# Altium schematic sheet Schematic4.SchDoc
size A4
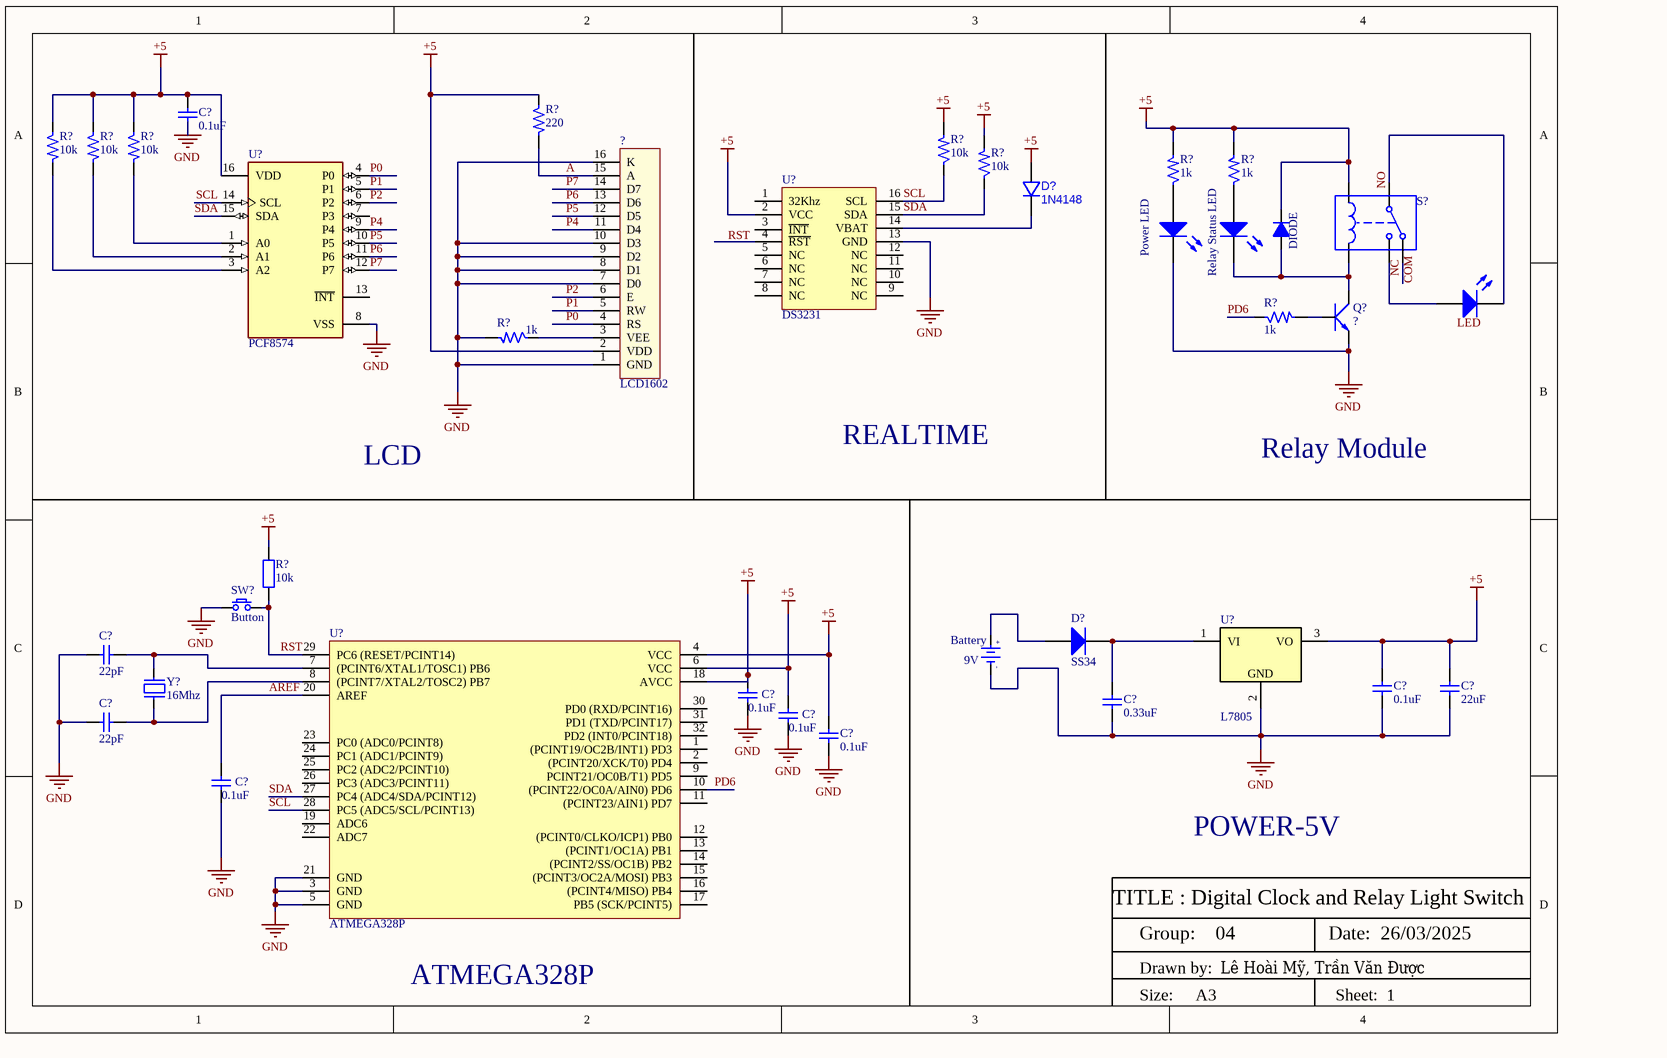
[diagram p0: Schematic4.SchDoc]

## Parts
(Parts that share a designator on the sheet are numbered #1, #2 ... from top to bottom, then left to right.)
?  LCD1602  [LCD1602 with Jump]
Battery  9V  [De Pin 9V]
C?#1  0.1uF  [C 0402 (1005)]
C?#2  22pF  [C 0402 (1005)]
C?#3  0.1uF  [C 0402 (1005)]
C?#4  22uF  [C 0402 (1005)]
C?#5  0.33uF  [C 0402 (1005)]
C?#6  0.1uF  [C 0402 (1005)]
C?#7  22pF  [C 0402 (1005)]
C?#8  0.1uF  [C 0402 (1005)]
C?#9  0.1uF  [C 0402 (1005)]
C?#10  0.1uF  [C 0402 (1005)]
D?#1  1N4148  [SOD523F]
D?#2  SS34  [DIODE SMA]
DIODE  100v  [DIODE 1A]  (value not drawn)
Power_LED  Light-Emitting Diode  (value not drawn)
Power_LED?  Light-Emitting Diode  (value not drawn)
Q?  ?  [TO92]
R?#1  220  [R1/4W]
R?#2  10k  [SM-RES-1206]
R?#3  10k  [SM-RES-1206]
R?#4  10k  [SM-RES-1206]
R?#5  10k  [R1/4W]
R?#6  10k  [R1/4W]
R?#7  1k  [R1/4W]
R?#8  1k  [R1/4W]
R?#9  1k  [R1/4W]
R?#10  1k  [R1/4W]
R?#11  10k  [tro vach 1/4w]
Relay_Status_LED  Light-Emitting Diode  (value not drawn)
S?  Single-Pole, Double-Throw Relay  (value not drawn)
SW?  Button  [SW/2/DIP]
U?#1  PCF8574  [FP-SOT162-1-MFG]
U?#2  DS3231  [SOIC 16]
U?#3  L7805  [DPAK_118_446_112X59_SMD]
U?#4  ATMEGA328P  [TQFP-32]
Y?  16Mhz  [Thach Anh 2 chan SMD]

## Nets
+5: ?.2(VDD) C?#1.2 C?#3.1 C?#4.1 C?#6.2 C?#8.2 C?#9.2 D?#1.A DIODE.2(K) R?#1.1 R?#2.1 R?#3.1 R?#4.1 R?#5.2 R?#6.2 R?#7.2 R?#8.2 R?#11.2 S?.4 U?#1.16(VDD) U?#2.2(VCC) U?#3.3(VO) U?#4.4(VCC) U?#4.6(VCC) U?#4.18(AVCC)
GND: ?.1(GND) ?.7(D0) ?.8(D1) ?.9(D2) ?.10(D3) ?.16(K) Battery.2(GND) C?#1.1 C?#2.2 C?#3.2 C?#4.2 C?#5.2 C?#6.1 C?#7.1 C?#8.1 C?#9.1 C?#10.1 Power_LED.2(K) Q?.1(E) R?#10.2 SW?.1 U?#1.8(VSS) U?#2.13(GND) U?#3.2 U?#4.3(GND) U?#4.5(GND) U?#4.21(GND)
A: ?.15(A) R?#1.2
AREF: C?#10.2 U?#4.20(AREF)
NC: S?.3
P0: ?.4(RS) U?#1.4(P0)
P1: ?.5(RW) U?#1.5(P1)
P2: ?.6(E) U?#1.6(P2)
P4: ?.11(D4) U?#1.9(P4)
P5: ?.12(D5) U?#1.10(P5)
P6: ?.13(D6) U?#1.11(P6)
P7: ?.14(D7) U?#1.12(P7)
PD6: R?#9.1 U?#4.10((PCINT22/OC0A/AIN0)_PD6)
RST: R?#11.1 SW?.2 U?#4.29(PC6_(RESET/PCINT14))
SCL: R?#5.1 U?#1.14(SCL) U?#2.16(SCL) U?#4.28(PC5_(ADC5/SCL/PCINT13))
SDA: R?#6.1 U?#1.15(SDA) U?#2.15(SDA) U?#4.27(PC4_(ADC4/SDA/PCINT12))
Net?_3: ?.3(VEE) R?#10.1
NetBattery_1: Battery.1(+3V) D?#2.1(A)
NetC?#2_1: C?#2.1 U?#4.7((PCINT6/XTAL1/TOSC1)_PB6) Y?.2
NetC?#5_1: C?#5.1 D?#2.2(K) U?#3.1(VI)
NetC?#7_2: C?#7.2 U?#4.8((PCINT7/XTAL2/TOSC2)_PB7) Y?.1
NetD?#1_K: D?#1.K U?#2.14(VBAT)
NetDIODE_1: DIODE.1(A) Q?.3(C) Relay_Status_LED.2(K) S?.5
NetPower_LED?_1: Power_LED?.1(A) S?.2
NetPower_LED?_2: Power_LED?.2(K) S?.1
NetPower_LED_1: Power_LED.1(A) R?#7.1
NetQ?_2: Q?.2(B) R?#9.2
NetR?#2_2: R?#2.2 U?#1.3(A2)
NetR?#3_2: R?#3.2 U?#1.2(A1)
NetR?#4_2: R?#4.2 U?#1.1(A0)
NetR?#8_1: R?#8.1 Relay_Status_LED.1(A)

Not connected (* = marked no-connect by the designer): U?#1 7(P3) 13(~{INT}); U?#2 1(32Khz) 3(~{INT}) 4(~{RST}) 5(NC) 6(NC) 7(NC) 8(NC) 9(NC) 10(NC) 11(NC) 12(NC); U?#4 1((PCINT19/OC2B/INT1)_PD3) 2((PCINT20/XCK/T0)_PD4) 9(PCINT21/OC0B/T1)_PD5) 11((PCINT23/AIN1)_PD7) 12((PCINT0/CLKO/ICP1)_PB0) 13((PCINT1/OC1A)_PB1) 14((PCINT2/SS/OC1B)_PB2) 15((PCINT3/OC2A/MOSI)_PB3) 16((PCINT4/MISO)_PB4) 17(PB5_(SCK/PCINT5)) 19(ADC6) 22(ADC7) 23(PC0_(ADC0/PCINT8)) 24(PC1_(ADC1/PCINT9)) 25(PC2_(ADC2/PCINT10)) 26(PC3_(ADC3/PCINT11)) 30(PD0_(RXD/PCINT16)) 31(PD1_(TXD/PCINT17)) 32(PD2_(INT0/PCINT18))

## Notes on the sheet
- REALTIME
- LCD
- Relay Module
- POWER-5V
- TITLE : Digital Clock and Relay Light Switch
- ATMEGA328P
- Group:    04
- Drawn by:
- Lê Hoài Mỹ, Trần Văn Được
- Date:  26/03/2025
- Size:     A3
- Sheet:  1
- Labels drawn without touching a wire or pin: COM, LED, NO, RST
- (in symbol De pin 9V cam) +; -
- (in symbol REG_35V_5V-1.5A-7.5W-DPAK) GND

## Library data of the parts
? = LCD1602 XL: LCD 1602 Xanh Lá; Ten: Màn hình LCD 1602 Xanh Lá; Ma_Hang: 67HZ; NCC: NSHOP; CHIP: HD44780
Battery = De pin 9V cam: De Pin 9V; Ten: Hộp Đế Pin 9V Thường; Ma_Hang: MH002680
C?#1-C?#10 = Capacitor NP: Capacitor non-pol
D?#1 = DIODE_1N4148_200mA_SOD523F: Diode SMD small signal 0.2A SOD-523F; Manufacturer 1: Fairchild Semiconductor; Manufacturer Part Number 1: 1N4148WT; Ratings: Vr=75V; Vf=1V@10mA; Io=200mA; Material: Si; SCDType: source; Package / Case: SC-79, SOD-523F; Supplier 1: Digi-Key; Supplier Part Number 1: 1N4148WTCT-ND; ComponentLink1URL: http://www.fairchildsemi.com/ds/1N/1N914BWT.pdf; ComponentLink1Description: http://www.fairchildsemi.com/ds/1N/1N914BWT.pdf; Value: 1N4148
D?#2 = Diode SS34 ( 1N5822 ): Dán; Don_Vi: Con; Ma_Hang: MH002104; Ten_Linh_Kien: Diode SS34 3A 40V SMA ( 1N5822 SS34A); Kieu_Chan: *; Chung_Loai: Dán
DIODE = Diode 1N4007: Cắm; Ten_Linh_Kien: Diode 1N4007 1A (DIP); Don_Vi: Con; Ma_Hang: MH001063; Ghi Chu: *; Kieu_Chan: *; Chung_Loai: Cắm
Power_LED Power_LED? Relay_Status_LED = LED: AF: 1; BV: 0; BV_MAX: 1e99; EG: 1.11; FC: 0.5; IBV: 0.001; IS: 1e-14; MJSW: 0.33; NTUN: 30; TNOM: 27; XTI: 3; SimulationGenericComponent: True; CJO: 0; CJP: 0; CTA: 0; CTP: 0; FCS: 0.5; FV_MAX: 1e99; IKF: 0; IKR: 0; ISR: 1e-14; JSW: 0; JTUN: 0; JTUNSW: 0; KEG: 1; KF: 0; LEVEL: 1; N: 1; NBV: 1; NR: 1; NS: 1; PHP: 1; RS: 0; TCV: 0; TLEV: 0; TLEVC: 0; TM1: 0; TM2: 0; TPB: 0; TPHP: 0; TRS: 0; TRS2: 0; TT: 0; TTT1: 0; TTT2: 0; VJ: 1; XTITUN: 3
Q? = Trans 2N3904: NPN transistor EBC; Value: C9014
R?#1 R?#5-R?#10 = Res
R?#2-R?#4 = R: Resistor 1/4W; Value: R1/4W - 1K
R?#11 = Tro Vach 1/4W 5% 10k: Căm; Chung_Loai: Cắm; Don_Vi: Con; So_Chan: 2; Ten_Linh_Kien: Trở Vạch 1/4w 5% 10K; Ma_Hang: MH007354; Kieu_Chan: *
S? = SPDT Relay: L_C: 1u; R_C: 100; RON: 1; ROFF: 1e12; ION: 1m; IOFF: 0; SimulationGenericComponent: True
SW? = SW SPST: Tact switch 2 pin
U?#1 = CMP-10112-000010-1: IC I/O EXPANDER I2C 8B 16SOIC; Manufacturer Part Number: PCF8574T/3,518; Manufacturer: NXP Semiconductors; Frequency: 100kHz; Max Supply Voltage: 6V; Standoff Height: 0.1mm; Nominal Supply Current: 40uA; Max Junction Temp: +125°C; Min Supply Voltage: 2.5V; Number Of I/Os: 8; Footprint Url: https://www.nxp.com/docs/en/package-information/SOT162-1.pdf; ComponentLink2URL: https://www.nxp.com/docs/en/data-sheet/PCF8574_PCF8574A.pdf; Automotive: No; Digikey Description: IC I/O EXPANDER I2C 8B 16SOIC; Mouser Description: PCF8574 Series 2.5 - 6V Remote 8-bit I/O Expander for I2C-bus - SOIC-16; Ipc Land Pattern Name: SOIC127P1032X265-16; Interface: I2C; Octopart: https://octopart.com/pcf8574t%2F3%2C518-nxp+semiconductors-10470852; Ambient Temperature Range Low: -40°C; Lead Free: Yes; Device Class L2: Interface ICs; Temperature Range High: +85°C; Device Class L1: Integrated Circuits (ICs); Package: SOT162-1; ComponentLink2Description: Datasheet; Device Class L3: I/O Expanders; Temperature: -40°C to +85°C; Ambient Temperature Range High: +85°C; Height: 2.65mm; Category: IC; RoHS: TRUE; Temperature Range Low: -40°C
U?#2 = DS3231 SMD: SOIC
U?#3 = REG_35V_5V-1.5A-7.5W-DPAK: Linear Voltage Regulator IC 1 Output 1.5A DPAK; Manufacturer: Diodes; Manufacturer Part Number: L7805CDT-TR; Alternate Part Number-1: CJ7805 3%; Case/Package: DPAK; Supplier-1: SP ROAD; Supplier Part Number-1: L7805CDT-TR
U?#4 = IC_ATMEGA328P: AVR AVR® ATmega Microcontroller IC 8-Bit 20MHz 32KB (16K x 16) FLASH 32-TQFP (7x7); Manufacturer: Microchip Technology; Manufacturer Part Number: ATMEGA328P-AUR; Alternate Part Number-1: NA; Case/Package: 32-TQFP; Supplier-1: Arrow; Supplier Part Number-1: ATMEGA328P-AUR
Y? = Thach Anh 2 chan SMD: Crystal For all Crystal 2pin.; Value: 4Mhz